# EAGLE design MicroMod-Big Display-Carrier (EAGLE 9.6.2)
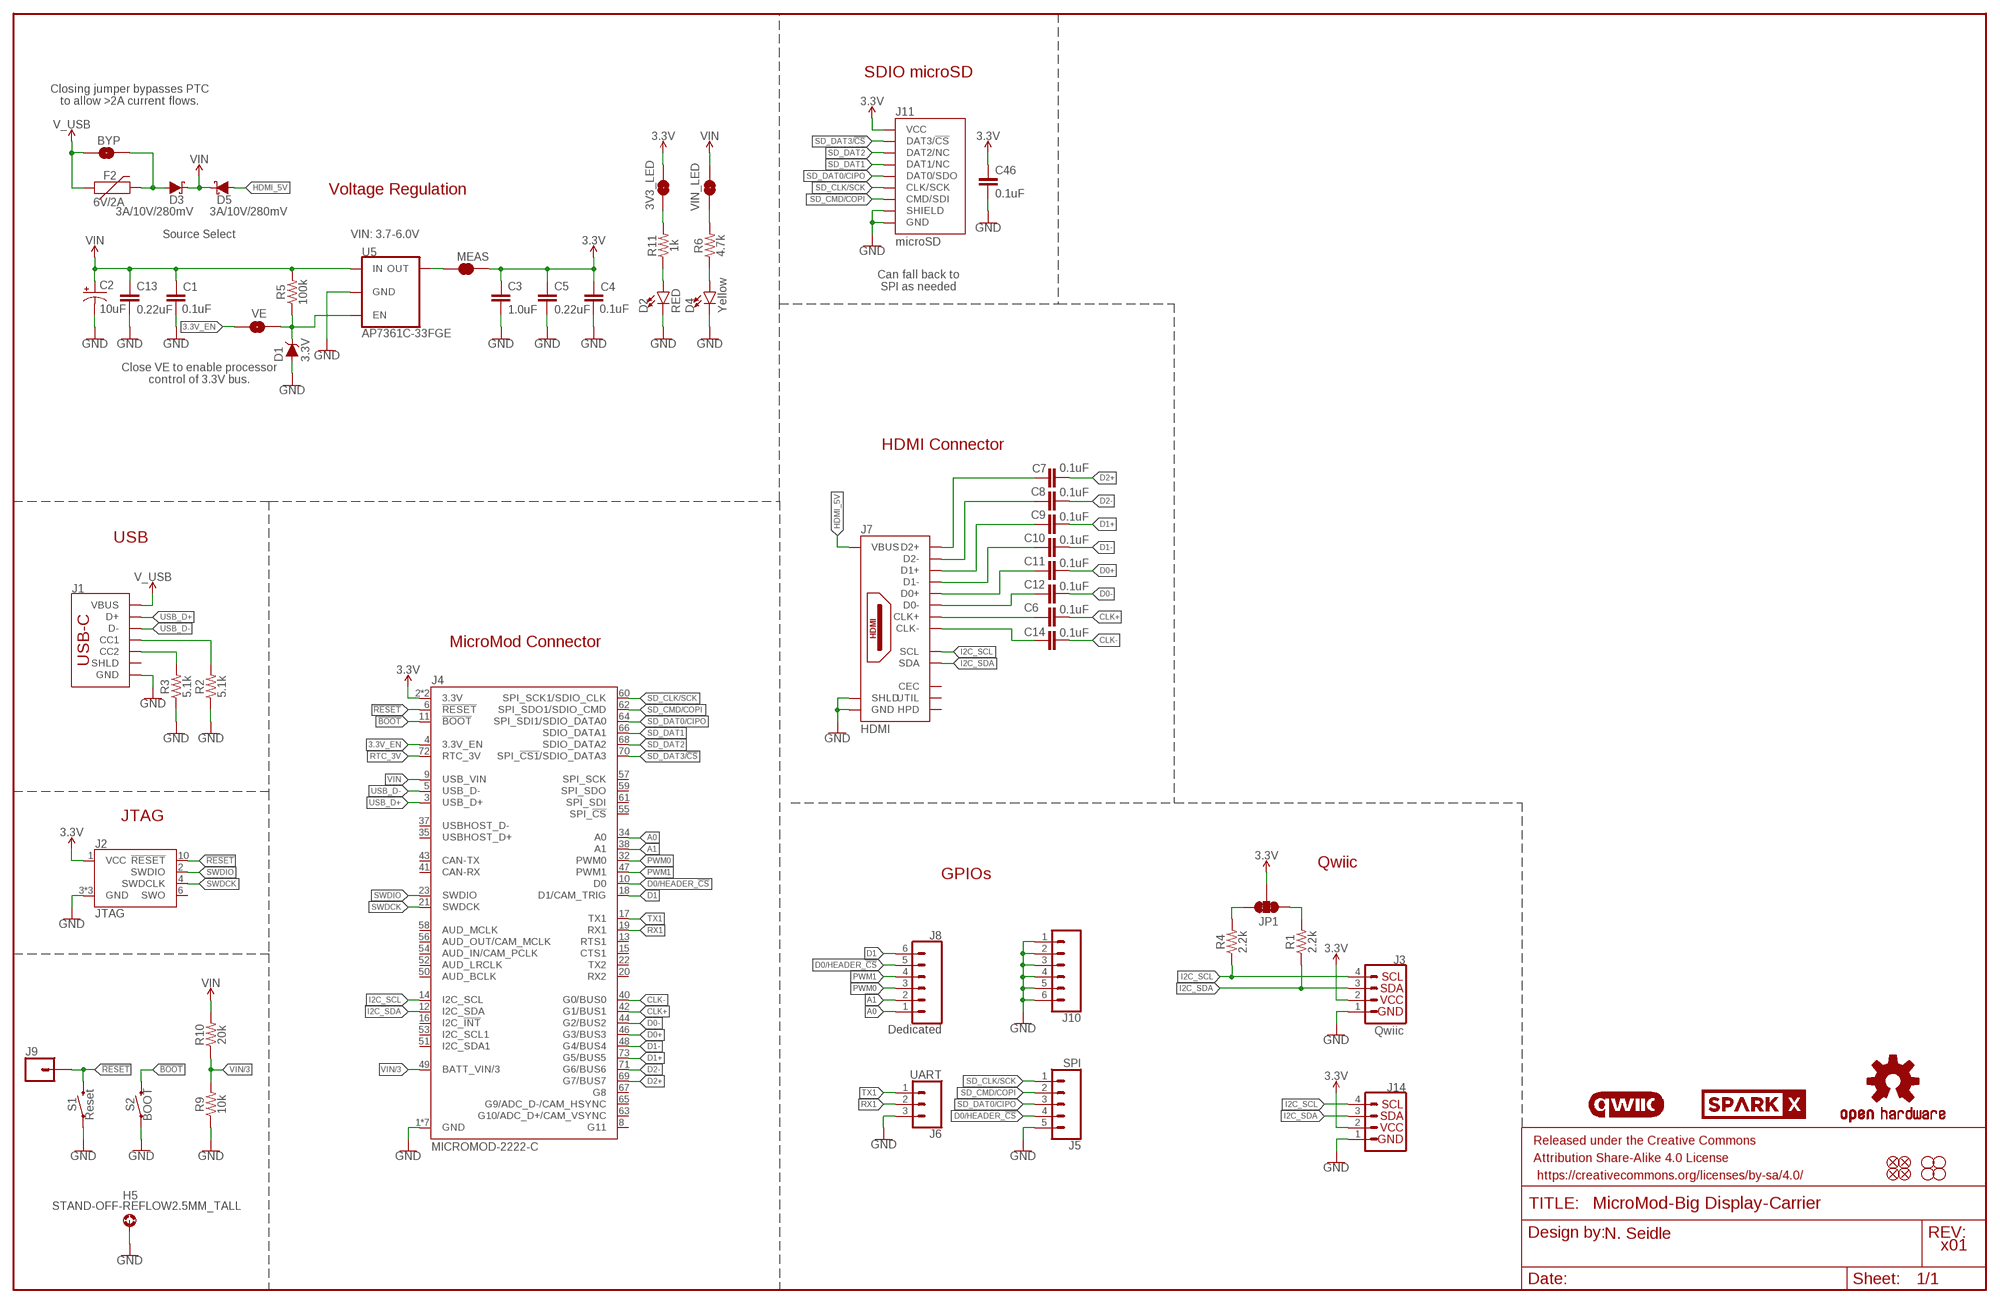
[diagram p0: schematic, sheet 1]

## Parts
3V3_LED  JUMPER-SMT_2_NC_TRACE_SILK  [SMT-JUMPER_2_NC_TRACE_SILK]
BYP  JUMPER-SMT_2_NO_SILK  [SMT-JUMPER_2_NO_SILK]
C1  0.1uF  0.1UF-0603-25V-(+80/-20%)  [0603]
C2  10uF  10UF-POLAR-EIA3216-16V-10%(TANT)  [EIA3216]
C3  1.0uF  1.0UF-0603-16V-10%  [0603]
C4  0.1uF  0.1UF-0603-25V-(+80/-20%)  [0603]
C5  0.22uF  0.22UF-0603-25V-10%  [0603]
C6  0.1uF  0.1UF-0603-25V-5%  [0603]
C7  0.1uF  0.1UF-0603-25V-5%  [0603]
C8  0.1uF  0.1UF-0603-25V-5%  [0603]
C9  0.1uF  0.1UF-0603-25V-5%  [0603]
C10  0.1uF  0.1UF-0603-25V-5%  [0603]
C11  0.1uF  0.1UF-0603-25V-5%  [0603]
C12  0.1uF  0.1UF-0603-25V-5%  [0603]
C13  0.22uF  0.22UF-0603-25V-10%  [0603]
C14  0.1uF  0.1UF-0603-25V-5%  [0603]
C46  0.1uF  0.1UF-0603-25V-(+80/-20%)  [0603]
D1  3.3V  DIODE-ZENER-MM3Z3V3T1G  [SOD-323]
D2  RED  LED-RED0603  [LED-0603]
D3  3A/10V/280mV  DIODE-SCHOTTKY-BAT60A  [SOD-323]
D4  Yellow  LED-YELLOW0603  [LED-0603]
D5  3A/10V/280mV  DIODE-SCHOTTKY-BAT60A  [SOD-323]
F2  6V/2A  PPTC_6V2A  [1210]
FD1  FIDUCIALUFIDUCIAL  [FIDUCIAL-MICRO]
FD2  FIDUCIALUFIDUCIAL  [FIDUCIAL-MICRO]
FD3  FIDUCIALUFIDUCIAL  [FIDUCIAL-MICRO]
FD4  FIDUCIALUFIDUCIAL  [FIDUCIAL-MICRO]
FRAME1  FRAME-LEDGER  [CREATIVE_COMMONS]
H1  STAND-OFF  [STAND-OFF]
H2  STAND-OFF  [STAND-OFF]
H3  STAND-OFF  [STAND-OFF]
H4  STAND-OFF  [STAND-OFF]
H5  STAND-OFF-REFLOW2.5MM_TALL  [STAND-OFF-REFLOW-M2.5]
J1  USB_C_2-LAYER_PADS  [USB-C-16P-2LAYER-PADS]
J2  JTAG  CORTEX_JTAG_DEBUG_MINIMUM_PTH  [2X5-PTH-1.27MM]
J3  Qwiic  QWIIC_CONNECTORJS-1MM  [JST04_1MM_RA]
J4  MICROMOD-2222-C  [M.2-CONNECTOR-E]
J5  SPI  CONN_05NO_SILK  [1X05_NO_SILK]
J6  UART  CONN_031X03_NO_SILK  [1X03_NO_SILK]
J7  HDMI  MOLEX_HDMI_208658-1051  [MOLEX_HDMI_208658-1051]
J8  Dedicated  CONN_06NO_SILK_NO_POP  [1X06_NO_SILK]
J9  CONN_01PTH_NO_SILK_YES_STOP  [1X01_NO_SILK]
J10  CONN_06NO_SILK_NO_POP  [1X06_NO_SILK]
J11  microSD  MICRO-SD-SDIOPUSH-PUSH  [MICRO-SD-SOCKET]
J14  I2C_STANDARD_NO_SILK  [1X04_NO_SILK]
JP1  JUMPER-SMT_3_2-NC_TRACE_SILK  [SMT-JUMPER_3_2-NC_TRACE_SILK]
LOGO2  QWIIC_LOGO_CONNECTOR  [QWIIC_5.5MM]
LOGO3  OSHW-LOGOMINI  [OSHW-LOGO-MINI]
MEAS  JUMPER-COMBO_2_NC_TRACE  [COMBO-JUMPER_2_NC_TRACE]
R1  2.2k  2.2KOHM-0603-1/10W-1%  [0603]
R2  5.1k  5.1KOHM5.1KOHM-0603-1/10W-1%  [0603]
R3  5.1k  5.1KOHM5.1KOHM-0603-1/10W-1%  [0603]
R4  2.2k  2.2KOHM-0603-1/10W-1%  [0603]
R5  100k  100KOHM-0603-1/10W-1%  [0603]
R6  4.7k  4.7KOHM-0603-1/10W-1%  [0603]
R9  10k  10KOHM-0603-1/10W-1%  [0603]
R10  20k  20KOHM-0603-1/10W-1%  [0603]
R11  1k  1KOHM-0603-1/10W-1%  [0603]
S1  Reset  MOMENTARY-SWITCH-SPST-SMD-5.2-TALL-REDUNDANT  [TACTILE_SWITCH_SMD_5.2MM]
S2  BOOT  MOMENTARY-SWITCH-SPST-SMD-5.2-TALL-REDUNDANT  [TACTILE_SWITCH_SMD_5.2MM]
U5  AP7361C-33FGE  AP7361C-33FGEUDFN-8  [UDFN-8]
U$1  SPARKX-LOGO4  [SPARKX-MEDIUM]
VE  JUMPER-SMT_2_NO_SILK  [SMT-JUMPER_2_NO_SILK]
VIN_LED  JUMPER-SMT_2_NC_TRACE_SILK  [SMT-JUMPER_2_NC_TRACE_SILK]

## Nets
3.3V: 3V3_LED.2 C3.1 C4.1 C5.1 C46.1 J2.1(VCC) J3.2 J4.2(3.3V) J4.74(3.3V) J11.VCC J14.2 JP1.2 MEAS.2 MEAS.4
3.3V_EN: J4.4(3.3V_EN) VE.1
!BOOT!: J4.11(!BOOT!) S2.3 S2.4
!RESET!: J2.10(!RESET) J4.6(!RESET!) J9.1 S1.3 S1.4
A0: J4.34(A0) J8.1
A1: J4.38(A1) J8.2
CLK+: C6.1 J4.42(G1/BUS1)
CLK-: C14.1 J4.40(G0/BUS0)
D0+: C11.1 J4.46(G3/BUS3)
D0-: C12.1 J4.44(G2/BUS2)
D0/HEADER_!CS!: J4.10(D0) J5.4 J8.5
D1: J4.18(D1/CAM_TRIG) J8.6
D1+: C9.1 J4.73(G5/BUS5)
D1-: C10.1 J4.48(G4/BUS4)
D2+: C7.1 J4.69(G7/BUS7)
D2-: C8.1 J4.71(G6/BUS6)
GND: C1.2 C2.- C3.2 C4.2 C5.2 C13.2 C46.2 D1.A D2.C D4.C H5.1 J1.GND J1.GND2(GND) J2.3(GND) J2.5(GND) J2.9(GND) J3.1 J4.1(GND) J4.7(GND) J4.33(GND) J4.36(GND) J4.39(GND) J4.45(GND) J4.75(GND) J5.5 J6.3 J7.2(GND) J7.5(GND) J7.8(GND) J7.11(GND) J7.17(GND) J7.MH1(SHLD) J7.MH2(SHLD) J7.MH3(SHLD) J7.MH4(SHLD) J10.1 J10.2 J10.3 J10.4 J10.5 J10.6 J11.CD1(SHIELD) J11.GND J11.GND1(GND) J11.GND3(GND) J14.1 R2.1 R3.1 R9.1 S1.1 S1.2 S2.1 S2.2 U5.4(GND) U5.EP(GND)
HDMI_5V: D5.A J7.18(VBUS)
I2C_SCL: J3.4 J4.14(I2C_SCL) J7.15(SCL) J14.4 R4.1
I2C_SDA: J3.3 J4.12(I2C_SDA) J7.16(SDA) J14.3 R1.1
N$1: R6.2 VIN_LED.1
N$2: JP1.3 R4.2
N$3: JP1.1 R1.2
N$4: C7.2 J7.1(D2+)
N$5: C8.2 J7.3(D2-)
N$6: 3V3_LED.1 R11.2
N$7: D2.A R11.1
N$8: D4.A R6.1
N$9: C9.2 J7.4(D1+)
N$10: J1.A5(CC1) R2.2
N$11: J1.B5(CC2) R3.2
N$12: D1.C R5.1 U5.5(EN) VE.2
N$13: C10.2 J7.6(D1-)
N$14: C11.2 J7.7(D0+)
N$15: C12.2 J7.9(D0-)
N$16: C6.2 J7.10(CLK+)
N$17: C14.2 J7.12(CLK-)
N$18: BYP.2 D3.A F2.2
PWM0: J4.32(PWM0) J8.3
PWM1: J4.47(PWM1) J8.4
RTC_3V: J4.72(RTC_3V)
RX1: J4.19(RX1) J6.2
SD_CLK/SCK: J4.60(SPI_SCK1/SDIO_CLK) J5.1 J11.SCLK(CLK/SCK)
SD_CMD/COPI: J4.62(SPI_SDO1/SDIO_CMD) J5.2 J11.DI/CMD(CMD/SDI)
SD_DAT0/CIPO: J4.64(SPI_SDI1/SDIO_DATA0) J5.3 J11.DO/DAT0(DAT0/SDO)
SD_DAT1: J4.66(SDIO_DATA1) J11.DAT1(DAT1/NC)
SD_DAT2: J4.68(SDIO_DATA2) J11.DAT2(DAT2/NC)
SD_DAT3/!CS!: J4.70(SPI_!CS1!/SDIO_DATA3) J11.CS/DAT3(DAT3/!CS!)
SWDCK: J2.4(SWDCLK) J4.21(SWDCK)
SWDIO: J2.2(SWDIO) J4.23(SWDIO)
TX1: J4.17(TX1) J6.1
USB_D+: J1.A6(D+) J1.B6(D+) J4.3(USB_D+)
USB_D-: J1.A7(D-) J1.B7(D-) J4.5(USB_D-)
V_USB: BYP.1 F2.1 J1.VBUS1(VBUS) J1.VBUS2(VBUS)
VIN: C1.1 C2.+ C13.1 D3.C D5.C J4.9(USB_VIN) R5.2 R10.2 U5.8(IN) VIN_LED.2
VIN/3: J4.49(BATT_VIN/3) R9.2 R10.1
VREG_3.3V: MEAS.1 MEAS.3 U5.1(OUT)
Unconnected: J1.SHLD1(SHLD) J1.SHLD2(SHLD) J1.SHLD3(SHLD) J1.SHLD4(SHLD) J2.6(SWO) J4.8(G11) J4.13(RTS1) J4.15(CTS1) J4.16(I2C_!INT!) J4.20(RX2) J4.22(TX2) J4.35(USBHOST_D+) J4.37(USBHOST_D-) J4.41(CAN-RX) J4.43(CAN-TX) J4.50(AUD_BCLK) J4.51(I2C_SDA1) J4.52(AUD_LRCLK) J4.53(I2C_SCL1) J4.54(AUD_IN/CAM_PCLK) J4.55(SPI_!CS!) J4.56(AUD_OUT/CAM_MCLK) J4.57(SPI_SCK) J4.58(AUD_MCLK) J4.59(SPI_SDO) J4.61(SPI_SDI) J4.63(G10/ADC_D+/CAM_VSYNC) J4.65(G9/ADC_D-/CAM_HSYNC) J4.67(G8) J7.13(CEC) J7.14(UTIL) J7.19(HPD)

## Notes on the sheet
- SDIO microSD
- Closing jumper bypasses PTC
  to allow >2A current flows.
- Voltage Regulation
- Source Select | VIN: 3.7-6.0V
- Can fall back to
  SPI as needed
- Close VE to enable processor
  control of 3.3V bus.
- HDMI Connector
- USB
- MicroMod Connector
- JTAG
- Qwiic
- GPIOs
- N. Seidle
- x01

## Library data of the parts
3V3_LED VIN_LED = SparkFun-Jumpers:JUMPER-SMT_2_NC_TRACE: Normally closed trace jumper This jumper has a trace between two pads so it's normally closed (NC). Use a razor knife to open the connection. For best results follow the IPC guidelines for cutting traces: Cutout at least 0.063 mm (0.005 in). Remove all loose material to clean up the cut area. Seal the cut with an approved epoxy. Reapply solder to reclose the connection.
BYP VE = SparkFun-Jumpers:JUMPER-SMT_2_NO: Normally open jumper This jumper has two pads in close proximity to each other. Apply solder to close the connection. Round pads are easier to solder for beginners, but are a lot larger. SparkFun Product that uses the round pads: SparkFun EL Sequencer
C1 C4 C46 = SparkFun-Capacitors:0.1UF: 0.1µF ceramic capacitors A capacitor is a passive two-terminal electrical component used to store electrical energy temporarily in an electric field.; PROD_ID: CAP-00810
C2 = SparkFun-Capacitors:10UF-POLAR: 10.0µF polarized capacitors A capacitor is a passive two-terminal electrical component used to store electrical energy temporarily in an electric field.; PROD_ID: CAP-00811
C3 = SparkFun-Capacitors:1.0UF: 1µF ceramic capacitors A capacitor is a passive two-terminal electrical component used to store electrical energy temporarily in an electric field.; PROD_ID: CAP-00868
C5 C13 = SparkFun-Capacitors:0.22UF: 0.22µF ceramic capacitors A capacitor is a passive two-terminal electrical component used to store electrical energy temporarily in an electric field.; PROD_ID: CAP-07822
C6-C12 C14 = SparkFun-Capacitors:0.1UF: 0.1µF ceramic capacitors A capacitor is a passive two-terminal electrical component used to store electrical energy temporarily in an electric field.; PROD_ID: CAP-08604
D1 = SparkFun-DiscreteSemi:DIODE-ZENER: Zener Diode A Zener diode allows current to flow from its anode to its cathode like a normal semiconductor diode, but it also permits current to flow in the reverse direction when its "Zener voltage" is reached. - WIkipedia; PROD_ID: DIO-11284
D2 = SparkFun-LED:LED-RED: Red SMD LED Used in manufacturing of most products at SparkFun Packages: 0603 - SMD 0603 package [Product Link] <http://docs.avagotech.com/docs/AV02-0551EN> 0603 SMART - SMD 0603 SMART package ( more efficient and expensive)[Product Link] <http://www.osram-os.com/Graphics/XPic2/00077099_0.pdf> 1206 - SMD1206 package [Product Link] <https://www.sparkfun.com/datasheets/DevTools/LilyPad/Q150OVS4.pdff> SparkFun Products: Pro Mini 328 -5V <https://www.sparkfun.com/products/821> RedBoard <https://www.sparkfun.com/products/12757> IOIO-OTG <https://www.sparkfun.com/products/13613>; PROD_ID: DIO-00819
D3 D5 = SparkFun-DiscreteSemi:DIODE-SCHOTTKY: Schottky diode A Schottky diode is a semiconductor diode which has a low forward voltage drop and a very fast switching action.; PROD_ID: DIO-14072
D4 = SparkFun-LED:LED-YELLOW: Yellow SMD LED Used in manufacturing several products at SparkFun. Packages: 0603 - SMD 0603 package[Product Link] <http://www.kingbrightusa.com/product.asp?catalog_name=LED&product_id=APT1608SYCK> 0603 -SMART - SMART SMD 0603 package (more efficient/more expensive) [Product Link] <http://www.osram-os.com/osram_os/en/products/product-catalog/led-light-emitting-diodes/smartled-0603/ly-l29k/index.jsp> LilyPad - SMD1206 package[Product Datasheet] <https://www.sparkfun.com/datasheets/DevTools/LilyPad/Q150YUS4.pdf> SparkFun Products: Blynk Board <https://www.sparkfun.com/products/13794> IOIO-OTG <https://www.sparkfun.com/products/13613> XBee Explorer Serial <https://www.sparkfun.com/products/13225>; PROD_ID: DIO-09003
F2 = SparkFun-Fuses:PPTC: Resettable Fuse PPTC Resettable Fuse. Really a sort of resistor with a polymeric positive temperature coefficient whose resistance increases dramatically with an increase in temperature. When heated by the power passing through the resistance rises causing the current to be limited, protecting the circuit. This is achieved by the transition of the polymer from a crystalline to an amorphous state where the conductive carbon separates breaking the conductive pathways found in the cool crystalline structure. When a PPTC cools back down it resumes conducting letting the circuit turn back on. SparkFun Products: SparkFun RedBoard - Programmed with Arduino Pro Micro - 5V/16MHz Arduino Pro 328 - 5V/16MHz MP3 Trigger; PROD_ID: RES-14313
FD1-FD4 = SparkFun-Aesthetics:FIDUCIAL: Fiducial Alignment Points Point-of-reference for pick-and-place machines and other optical instruments.
FRAME1 = SparkFun-Aesthetics:FRAME-LEDGER: Schematic Frame - Ledger Standard 11x14 US Ledger frame
H1-H4 = SparkFun-Hardware:STAND-OFF: Stand Off Drill holes for mechanically mounting via screws, standoffs, etc. Note: Use the keepout ring to avoid running the screw head into surrounding components. Variant Overviews STAND-OFF - Mechanical footprint for a #4 phillips button head screw. STAND-OFF-TIGHT - Mechanical footprint for a #4 phillips button head screw, Example SparkFun Products Screw - Phillips Head (1/4", 4-40, 10 pack) (PRT-10453) Screw - Phillips Head (1/2", 4-40, 10 pack) (PRT-10452) Screw - Phillips Head (3/4", 4-40, 10 pack) (PRT-10451) Screw - Phillips Head (1", 4-40, 10 pack) (PRT-10450)
H5 = SparkFun-Hardware:STAND-OFF-REFLOW: Stand Off Reflow Compatible A metal standoff that can be placed and reflowed onto a PCB.; PROD_ID: HW-14899
J1 = SparkFun-Connectors:USB_C: USB Type C 16Pin Connector Super Speed pins not available on the 16-pin purely SMD connector so this part is best for USB 2.0 implementations. D1 and D2 are tied together enabling D+/- no matter which way the cable is plugged into the connector. The two channel configuration pins (CC1/2) are exposed. These are normally connected to ground via 5.1k resistors but can be reconfigured for high current/high power applications. **4-LAYER BOARD WARNING!!** If designing 4-layer board, make sure to select the variant _4-LAYER-ISOLATED. The linked footprint (USB-C-16-4LAYER-ISOLATED) includes some very necessary cutout polygons in the inner layers (2 and 15). This prevents the PTH mounting shield legs on the USB connector from electrically connecting any other polygons on the inner layers (usually VCC and GND).; PROD_ID: CONN-14122
J2 = SparkFun-Connectors:CORTEX_JTAG_DEBUG_MINIMUM: Cortex Debug Connector - 10 pin Supports JTAG debug, Serial Wire debug, and Serial Wire Viewer. PTH and SMD connector options available. General Connector Information <http://infocenter.arm.com/help/topic/com.arm.doc.faqs/attached/13634/cortex_debug_connectors.pdf> Products: PTH Connector <http://www.digikey.com/product-detail/en/cnc-tech/3220-10-0100-00/1175-1627-ND/3883661> -via Digi-Key SparkFun PSoc <https://www.sparkfun.com/products/13229> SparkFun T <https://www.sparkfun.com/products/13810>
J3 = SparkFun-Connectors:QWIIC_CONNECTOR: SparkFun I2C Standard Qwiic Connector An SMD 1mm pitch JST connector makes it easy and quick (get it? Qwiic?) to connect I2C devices to each other. The Qwiic system <http://www.sparkfun.com/qwiic> enables fast and solderless connection between popular platforms and various sensors and actuators. We carry 200mm <https://www.sparkfun.com/products/14204>, 100mm <https://www.sparkfun.com/products/14205>, 50mm <https://www.sparkfun.com/products/14206>, and breadboard friendly <https://www.sparkfun.com/products/14207> Qwiic cables. We also offer 10 pcs strips <https://www.sparkfun.com/products/14323> the SMD connectors.; PROD_ID: CONN-13694; VALUE: QWIIC_RIGHT_ANGLE
J4 = SparkFun-MicroMod:MICROMOD: MicroMod Connector Description: A card edge connector and mating PCB connector to allow various MicroMod Processor Boards to be coupled with various carrier boards of different capabilities. Based on the M.2 standard.; PROD_ID: CONN-14877
J5 = SparkFun-Connectors:CONN_05: Multi connection point. Often used as Generic Header-pin footprint for 0.1 inch spaced/style header connections On any of the 0.1 inch spaced packages, you can populate with these: Break Away Headers - Straight (PRT-00116) Break Away Male Headers - Right Angle (PRT-00553) Female Headers (PRT-00115) Break Away Headers - Machine Pin (PRT-00117) Break Away Female Headers - Swiss Machine Pin (PRT-00743) For SCREWTERMINALS and SPRING TERMINALS visit here: Screw Terimnals on SparkFun.com (5mm/3.5mm/2.54mm spacing) This device is also useful as a general connection point to wire up your design to another part of your project. Our various solder wires solder well into these plated through hole pads. Hook-Up Wire - Assortment (Stranded, 22 AWG) (PRT-11375) Hook-Up Wire - Assortment (Solid Core, 22 AWG) (PRT-11367) View the entire wire category on our website here Special notes: Molex polarized connector foot print use with SKU : PRT-08231 with associated crimp pins and housings. 1MM SMD Version SKU: PRT-10208
J6 = SparkFun-Connectors:CONN_03: Multi connection point. Often used as Generic Header-pin footprint for 0.1 inch spaced/style header connections On any of the 0.1 inch spaced packages, you can populate with these: Break Away Headers - Straight (PRT-00116) Break Away Male Headers - Right Angle (PRT-00553) Female Headers (PRT-00115) Break Away Headers - Machine Pin (PRT-00117) Break Away Female Headers - Swiss Machine Pin (PRT-00743) Stackable Header - 3 Pin (Female, 0.1") (PRT-13875) For SCREWTERMINALS and SPRING TERMINALS visit here: Screw Terimnals on SparkFun.com (5mm/3.5mm/2.54mm spacing) This device is also useful as a general connection point to wire up your design to another part of your project. Our various solder wires solder well into these plated through hole pads. Hook-Up Wire - Assortment (Stranded, 22 AWG) (PRT-11375) Hook-Up Wire - Assortment (Solid Core, 22 AWG) (PRT-11367) View the entire wire category on our website here Special notes: Molex polarized connector foot print use with SKU : PRT-08232 with associated crimp pins and housings.
J7 = New_Parts:MOLEX_HDMI_208658-1051: 1.0 HDMI R/A HEADER ASSY (I/M TYPE) Source: Datasheet
J8 J10 = SparkFun-Connectors:CONN_06: Multi connection point. Often used as Generic Header-pin footprint for 0.1 inch spaced/style header connections On any of the 0.1 inch spaced packages, you can populate with these: Break Away Headers - Straight (PRT-00116) Break Away Male Headers - Right Angle (PRT-00553) Female Headers (PRT-00115) Break Away Headers - Machine Pin (PRT-00117) Break Away Female Headers - Swiss Machine Pin (PRT-00743) Arduino Stackable Header - 6 Pin (PRT-09280) For SCREWTERMINALS and SPRING TERMINALS visit here: Screw Terimnals on SparkFun.com (5mm/3.5mm/2.54mm spacing) This device is also useful as a general connection point to wire up your design to another part of your project. Our various solder wires solder well into these plated through hole pads. Hook-Up Wire - Assortment (Stranded, 22 AWG) (PRT-11375) Hook-Up Wire - Assortment (Solid Core, 22 AWG) (PRT-11367) View the entire wire category on our website here
J9 = SparkFun-Connectors:CONN_01: Single connection point. Often used as Generic Header-pin footprint for 0.1 inch spaced/style header connections On any of the 0.1 inch spaced packages, you can populate with these: Break Away Headers - Straight (PRT-00116) Break Away Male Headers - Right Angle (PRT-00553) Female Headers (PRT-00115) Break Away Headers - Machine Pin (PRT-00117) Break Away Female Headers - Swiss Machine Pin (PRT-00743) This device is also useful as a general connection point to wire up your design to another part of your project. Our various solder wires solder well into these plated through hole pads. Hook-Up Wire - Assortment (Stranded, 22 AWG) (PRT-11375) Hook-Up Wire - Assortment (Solid Core, 22 AWG) (PRT-11367) View the entire wire category on our website here Special notes: SMTSO-256-ET is a "flush mount" nut for a 4-40 screw. We mostly use this on specialty testbeds; it is a nice way to connect hardware to your PCB at an adjustable hieght. Also note, the SNAP packages are for using a snappable style connector. We sell a baggie of snaps and they are also used on two LilyPad designs: Snap Assortment - 30 pack (male and female) (DEV-11347) LilyPad Arduino SimpleSnap (DEV-10941) LilyPad SimpleSnap Protoboard (DEV-10940)
J11 = SparkFun-Connectors:MICRO-SD-SDIO: microSD Socket for Transflash Push-push type µSD socket. tDoc lines correctly indicate media card edge positions when inserting (unlocked, locked, depressed). NOTE: CD1 and CD2 are connected internally, and the default detect state of the socket is detect pin to ground. SparkFun Products: WAV Trigger <https://www.sparkfun.com/products/13660> CAN-Bus Shield <https://www.sparkfun.com/products/13262> SparkFun Level Shifing microSD Breakout <https://www.sparkfun.com/products/13743>; PROD_ID: CONN-07820
J14 = SparkFun-Connectors:I2C_STANDARD: SparkFun I2C Standard Pinout Header SparkFun has standardized on a pinout for all I2C based sensor breakouts. This pinout allows I2C boards to be plugged directly into the headers on Arduino Uno compatible boards, and to be daisy chained easily. Example SparkFun Products: SparkFun Atmospheric Sensor Breakout - BME280 <https://www.sparkfun.com/products/13676> SparkFun Altitude/Pressure Sensor Breakout - MPL3115A2 <https://www.sparkfun.com/products/11084> SparkFun TOF Range Finder Sensor - VL6180 <https://www.sparkfun.com/products/12785>
JP1 = SparkFun-Jumpers:JUMPER-SMT_3_2-NC_TRACE: Normally closed trace jumper (2 of 2 connections) This jumper has a trace between all three pads so they are normally closed (NC). Use a razor knife to open the connection(s). For best results follow the IPC guidelines for cutting traces: Cutout at least 0.063 mm (0.005 in). Remove all loose material to clean up the cut area. Seal the cut with an approved epoxy. Reapply solder to reclose the connection(s).
LOGO2 = SparkFun-Aesthetics:QWIIC_LOGO: Qwiic Logos for placement on schematic and PCB. The 5.5mm silk logo is best for placing next to Qwiic connector.
LOGO3 = SparkFun-Aesthetics:OSHW-LOGO: Open-Source Hardware (OSHW) Logo This logo indicates the piece of hardware it is found on incorporates a OSHW license and/or adheres to the definition of open source hardware found here: http://freedomdefined.org/OSHW
MEAS = SparkFun-Jumpers:JUMPER-COMBO_2_NC_TRACE
R1 R4 = SparkFun-Resistors:2.2KOHM: 2.2kΩ resistor A resistor is a passive two-terminal electrical component that implements electrical resistance as a circuit element. Resistors act to reduce current flow, and, at the same time, act to lower voltage levels within circuits. - Wikipedia; PROD_ID: RES-08272
R2 R3 = SparkFun-Resistors:5.1KOHM; PROD_ID: RES-12083
R5 = SparkFun-Resistors:100KOHM: 100kΩ resistor A resistor is a passive two-terminal electrical component that implements electrical resistance as a circuit element. Resistors act to reduce current flow, and, at the same time, act to lower voltage levels within circuits. - Wikipedia; PROD_ID: RES-07828
R6 = SparkFun-Resistors:4.7KOHM: 4.7kΩ resistor A resistor is a passive two-terminal electrical component that implements electrical resistance as a circuit element. Resistors act to reduce current flow, and, at the same time, act to lower voltage levels within circuits. - Wikipedia; PROD_ID: RES-07857
R9 = SparkFun-Resistors:10KOHM: 10kΩ resistor A resistor is a passive two-terminal electrical component that implements electrical resistance as a circuit element. Resistors act to reduce current flow, and, at the same time, act to lower voltage levels within circuits. - Wikipedia; PROD_ID: RES-00824
R10 = SparkFun-Resistors:20KOHM: 20kΩ resistor A resistor is a passive two-terminal electrical component that implements electrical resistance as a circuit element. Resistors act to reduce current flow, and, at the same time, act to lower voltage levels within circuits. - Wikipedia; PROD_ID: RES-09383
R11 = SparkFun-Resistors:1KOHM: 1kΩ resistor A resistor is a passive two-terminal electrical component that implements electrical resistance as a circuit element. Resistors act to reduce current flow, and, at the same time, act to lower voltage levels within circuits. - Wikipedia; PROD_ID: RES-07856
S1 S2 = SparkFun-Switches:MOMENTARY-SWITCH-SPST: Momentary Switch (Pushbutton) - SPST Normally-open (NO) SPST momentary switches (buttons, pushbuttons). Variants PTH-12MM - 12mm square, through-hole Momentary Pushbutton Switch - 12mm Square (COM-09190) PTH-6.0MM, PTH-6.0MM-KIT - 6.0mm square, through-hole Mini Pushbutton Switch (COM-00097) KIT package intended for soldering kit's - only one side of pads' copper is exposed. PTH-RIGHT-ANGLE-KIT - Right-angle, through-hole Right Angle Tactile Button - Used on SparkFun BigTime Watch Kit SMD-12MM - 12mm square, surface-mount Tactile Button - SMD (12mm) (COM-12993) Used on SparkFun PicoBoard SMD-4.5MM - 4.5mm Square Trackball Switch Used on SparkFun Blackberry Trackballer Breakout SMD-4.6MMX2.8MM - 4.60mm x 2.80mm, surface mount Used on SparkFun SAMD21 Mini Breakout SMD-5.2MM, SMD-5.2-REDUNDANT - 5.2mm square, surface-mount Mini Pushbutton Switch - SMD (COM-08720) Used on Arduino Pro Mini REDUNDANT package connects both switch circuits together SMD-6.0X3.5MM - 6.0 x 3.5mm, surface mount Momentary Reset Switch SMD (COM-08229) SMD-6.2MM-TALL - 6.2mm square, surface mount Tactile Button - SMD (6mm) Used on SparkFun Digital Sandbox SMD-RIGHT-ANGLE - Right-angle, surface mount Used on SparkFun Block for Intel® Edison - Arduino; PROD_ID: SWCH-14139
U5 = SparkFun-IC-Power:AP7361C-33FGE: AP7361C 3.3V LDO Regulator; PROD_ID: VREG-14094
U$1 = SparkX:SPARKX-LOGO

## Net classes
0 default: width 0 mm, drill 0 mm
1 power: width 0.762 mm

## Board
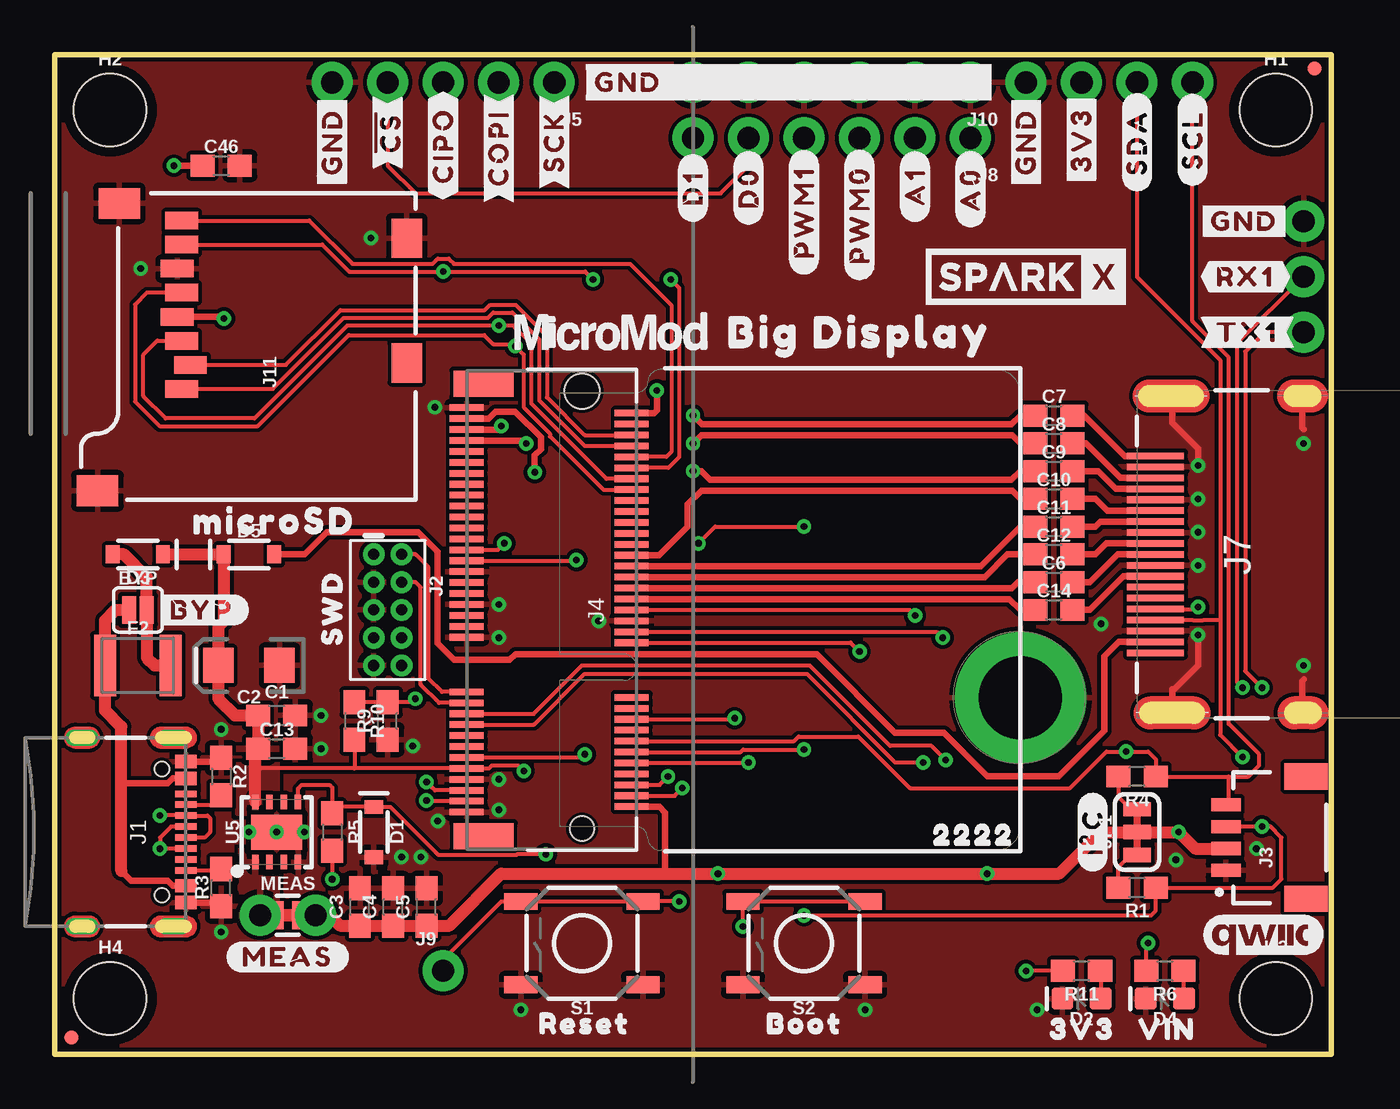
[diagram p1: board, top side]
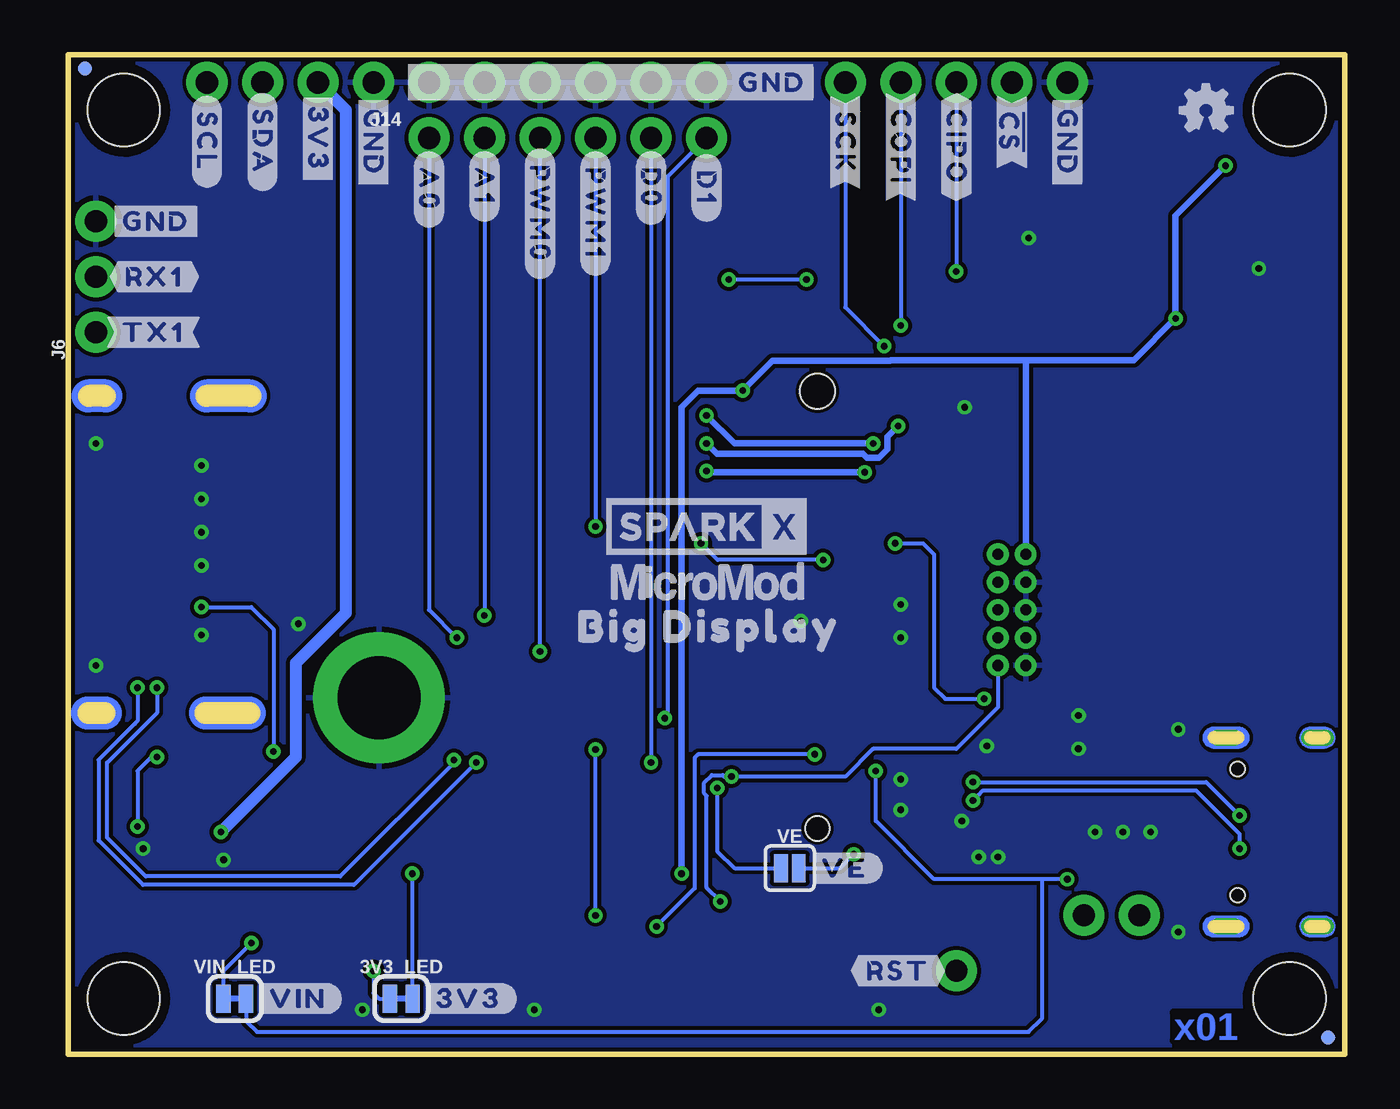
[diagram p2: board, bottom side, seen from below]

Size 58.42 x 45.72 mm. Coordinates in mm from the lower left corner, seen from the top.
Outline: 0,0 0,45.72 58.42,45.72 58.42,0 0,0
Copper layers (1*16): Top 0.035mm / dielectric 1.5mm / Bottom 0.035mm
Design rules "SparkFun-2-layer-TIGHT *": minimum track width 7mil, minimum drill 12mil, track to track 7mil, track to pad 7mil, pad to pad 7mil, via to via 7mil, smd to smd 7mil, copper to edge 7mil, drill to drill 7mil, minimum pad ring 7mil, minimum via ring 7mil, stop-mask expansion 4mil, vias tented up to drill 25mil, thermal gap 10mil

### Footprints (pad centres in the part's own frame; a part is rotated, then mirrored left to right if it is on the bottom)
SMT-JUMPER_2_NC_TRACE_SILK = smd 0.66 x 1.27: 1 -0.521,0; 2 0.521,0
SMT-JUMPER_2_NO_SILK = smd 0.635 x 1.27: 1 -0.406,0; 2 0.406,0
0603 = smd 1.1 x 1: 1 -0.85,0; 2 0.85,0
EIA3216 = smd 1.4 x 1.6: + 1.4,0; - -1.4,0
SOD-323 = smd 0.63 x 0.83: A 1.15,0; C -1.15,0
LED-0603 = smd 1 x 1: A -0.877,0; C 0.877,0
1210 = smd 1 x 2.8: 1 -1.5,0; 2 1.5,0
FIDUCIAL-MICRO = smd 0.635 x 0.635: 1 0,0
STAND-OFF = hole 3.302: 0,0
STAND-OFF-REFLOW-M2.5 = drill 3.8 pad 6: 1 0,0
USB-C-16P-2LAYER-PADS = smd 0.3 x 1: A5 -1.25,-0.34; A6 -0.25,-0.34; A7 0.25,-0.34; A8 1.25,-0.34; B5 1.75,-0.34; B6 0.75,-0.34; B7 -0.75,-0.34; B8 -1.75,-0.34 | smd 0.6 x 1: GND -3.225,-0.34; GND2 3.225,-0.34; VBUS1 -2.45,-0.34; VBUS2 2.45,-0.34 | drill 0.4 pad 0.6 long: SHLD1 -4.318,-0.915; SHLD2 4.318,-0.915; SHLD3 -4.318,-5.095; SHLD4 4.318,-5.095 | hole 0.65: -2.89,-1.445; 2.89,-1.445
2X5-PTH-1.27MM = drill 0.508 pad 1: 1 -2.54,-0.635; 2 -2.54,0.635; 3 -1.27,-0.635; 4 -1.27,0.635; 5 0,-0.635; 6 0,0.635; 7 1.27,-0.635; 8 1.27,0.635; 9 2.54,-0.635; 10 2.54,0.635
JST04_1MM_RA = smd 0.6 x 1.35: 1 -1.5,0; 2 -0.5,0; 3 0.5,0; 4 1.5,0 | smd 1.2 x 2: NC1 2.8,-3.675; NC2 -2.8,-3.675
M.2-CONNECTOR-E = smd 0.3 x 1.55: 1 9.25,-5.275; 2 9,2.275; 3 8.75,-5.275; 4 8.5,2.275; 5 8.25,-5.275; 6 8,2.275; 7 7.75,-5.275; 8 7.5,2.275; 9 7.25,-5.275; 10 7,2.275; 11 6.75,-5.275; 12 6.5,2.275; 13 6.25,-5.275; 14 6,2.275; 15 5.75,-5.275; 16 5.5,2.275; 17 5.25,-5.275; 18 5,2.275; 19 4.75,-5.275; 20 4.5,2.275; 21 4.25,-5.275; 22 4,2.275; 23 3.75,-5.275; 32 1.5,2.275; 33 1.25,-5.275; 34 1,2.275; 35 0.75,-5.275; 36 0.5,2.275; 37 0.25,-5.275; 38 0,2.275; 39 -0.25,-5.275; 40 -0.5,2.275; 41 -0.75,-5.275; 42 -1,2.275; 43 -1.25,-5.275; 44 -1.5,2.275; 45 -1.75,-5.275; 46 -2,2.275; 47 -2.25,-5.275; 48 -2.5,2.275; 49 -2.75,-5.275; 50 -3,2.275; 51 -3.25,-5.275; 52 -3.5,2.275; 53 -3.75,-5.275; 54 -4,2.275; 55 -4.25,-5.275; 56 -4.5,2.275; 57 -4.75,-5.275; 58 -5,2.275; 59 -5.25,-5.275; 60 -5.5,2.275; 61 -5.75,-5.275; 62 -6,2.275; 63 -6.25,-5.275; 64 -6.5,2.275; 65 -6.75,-5.275; 66 -7,2.275; 67 -7.25,-5.275; 68 -7.5,2.275; 69 -7.75,-5.275; 70 -8,2.275; 71 -8.25,-5.275; 72 -8.5,2.275; 73 -8.75,-5.275; 74 -9,2.275; 75 -9.25,-5.275 | smd 1.2 x 2.75: A1 10.35,-4.5; A2 -10.35,-4.5 | hole 1.1: 10,0 | hole 1.6: -10,0
1X05_NO_SILK = drill 1.016 pad 1.88: 1 0,0; 2 2.54,0; 3 5.08,0; 4 7.62,0; 5 10.16,0
1X03_NO_SILK = drill 1.016 pad 1.88: 1 0,0; 2 2.54,0; 3 5.08,0
MOLEX_HDMI_208658-1051 = smd 0.3 x 2.6: 1 4.5,4.235; 2 4,4.235; 3 3.5,4.235; 4 3,4.235; 5 2.5,4.235; 6 2,4.235; 7 1.5,4.235; 8 1,4.235; 9 0.5,4.235; 10 0,4.235; 11 -0.5,4.235; 12 -1,4.235; 13 -1.5,4.235; 14 -2,4.235; 15 -2.5,4.235; 16 -3,4.235; 17 -3.5,4.235; 18 -4,4.235; 19 -4.5,4.235 | drill 0.4 long: MH1 -7.25,3.475; MH2 7.25,3.475; MH3 -7.25,-2.485; MH4 7.25,-2.485
1X06_NO_SILK = drill 1.016 pad 1.88: 1 0,0; 2 2.54,0; 3 5.08,0; 4 7.62,0; 5 10.16,0; 6 12.7,0
1X01_NO_SILK = drill 1.016 pad 1.88: 1 0,0
MICRO-SD-SOCKET = smd 1.8 x 1.4: CD1 -2.05,0.4; CD2 -7.75,0.4 | smd 0.8 x 1.5: CS/DAT3 -7.84,10.3; DAT1 -1.24,10.7; DAT2 -8.94,10.7; DI/CMD -6.74,10.7; DO/DAT0 -2.34,10.7; GND -3.44,10.9; SCLK -4.54,10.7; VCC -5.64,10.9 | smd 1.4 x 1.9: GND1 -13.6,14.55; GND3 -0.45,13.55
1X04_NO_SILK = drill 1.016 pad 1.88: 1 0,0; 2 2.54,0; 3 5.08,0; 4 7.62,0
SMT-JUMPER_3_2-NC_TRACE_SILK = smd 0.66 x 1.27: 1 -1.041,0; 2 0,0; 3 1.041,0
COMBO-JUMPER_2_NC_TRACE = smd 0.635 x 1.27: 1 -0.508,0; 2 0.508,0 | drill 1.016 pad 1.88: 3 -1.27,0; 4 1.27,0
TACTILE_SWITCH_SMD_5.2MM = smd 1.524 x 0.762: 1 -2.794,1.905; 2 2.794,1.905; 3 -2.794,-1.905; 4 2.794,-1.905
UDFN-8 = smd 0.3 x 0.65: 1 -0.975,-1.375; 2 -0.325,-1.375; 3 0.325,-1.375; 4 0.975,-1.375; 5 0.975,1.375; 6 0.325,1.375; 7 -0.325,1.375; 8 -0.975,1.375 | smd 2.35 x 1.6: EP 0,0

### Placement (x,y rotation side)
3V3_LED  43.18,2.54 0 bottom
BYP  3.81,20.32 0 top
C1  10.16,15.49 0 top
C2  8.89,17.78 180 top
C3  13.97,6.73 90 top
C4  15.49,6.73 90 top
C5  17.02,6.73 90 top
C6  45.72,21.59 0 top
C7  45.72,29.21 0 top
C8  45.72,27.94 0 top
C9  45.72,26.67 0 top
C10  45.72,25.4 0 top
C11  45.72,24.13 0 top
C12  45.72,22.86 0 top
C13  10.16,13.97 0 top
C14  45.72,20.32 0 top
C46  7.62,40.64 0 top
D1  14.61,10.16 270 top
D2  46.99,2.54 180 top
D3  3.81,22.86 180 top
D4  50.8,2.54 180 top
D5  8.89,22.86 0 top
F2  3.81,17.78 0 top
FD1  0.76,0.76 0 top
FD2  57.66,45.09 0 top
FD3  0.76,0.76 0 bottom
FD4  57.66,45.09 0 bottom
FRAME1  1.27,-10.16 0 top  (outside the outline)
H1  55.88,43.18 0 top
H2  2.54,43.18 0 top
H3  55.88,2.54 0 top
H4  2.54,2.54 0 top
H5  44.2,16.3 0 top
J1  6.35,10.16 270 top
J2  15.24,20.32 270 top
J3  53.59,9.91 90 top
J4  24.13,20.32 270 top
J5  22.86,44.45 180 top
J6  57.15,33.02 90 bottom
J7  54.61,22.86 90 top
J8  41.91,41.91 180 top
J9  17.78,3.81 0 top
J10  41.91,44.45 180 top
J11  16.51,39.37 90 top
J14  44.45,44.45 180 bottom
JP1  49.53,10.16 90 top
LOGO2  55.31,5.46 0 top
LOGO3  6.35,43.18 0 bottom
MEAS  10.67,6.35 0 top
R1  49.53,7.62 180 top
R2  7.62,12.7 270 top
R3  7.62,7.62 90 top
R4  49.53,12.7 180 top
R5  12.7,10.16 270 top
R6  50.8,3.81 180 top
R9  15.24,15.24 90 top
R10  13.72,15.24 270 top
R11  46.99,3.81 180 top
S1  24.13,5.08 180 top
S2  34.29,5.08 180 top
U5  10.16,10.16 0 top
U$1  44.45,35.56 0 top
U$2  [MICROSD0]  10.03,24.38 0 top
U$3  [BIG_DISPLAY0]  36.83,33.02 0 top
U$4  [#3V3#0]  42.29,2.54 0 bottom
U$5  [BIG_DISPLAY0]  29.08,19.56 0 bottom
U$6  [#A0#5]  41.91,37.85 90 top
U$7  [#A0#5]  41.91,41.27 270 bottom
U$8  [#A1#4]  39.37,38.1 90 top
U$9  [#A1#4]  39.37,41.27 270 bottom
U$10  [#D0#1]  31.75,41.27 270 bottom
U$11  [#GND#0]  24,44.45 0 top
U$12  [#GND#0]  28.45,44.45 0 bottom
U$13  [#3V3#1]  46.99,39.62 90 top
U$14  [#3V3#1]  46.99,44.07 270 bottom
U$15  [#GND#0]  44.45,39.5 90 top
U$16  [#GND#0]  44.45,43.94 270 bottom
U$17  [#RST#1]  22.61,3.81 0 bottom
U$18  [#VE#0]  24.64,8.51 0 bottom
U$19  [#MEAS#2]  7.87,4.45 0 top
U$20  [#VIN#1]  49.91,2.54 0 bottom
U$21  [SWD0]  12.7,18.03 90 top
U$22  SPARKX-LOGO4  [SPARKX-MEDIUM]  29.21,24.13 0 bottom
U$23  [#I�C#0]  47.5,8.38 90 top
U$24  [MICROMOD_LOGO_.35]  25.4,33.02 0 top
U$25  [#D0#1]  31.75,37.97 90 top
U$29  [#D1#0]  29.21,38.1 90 top
U$31  [#D1#0]  29.21,41.15 270 bottom
U$32  [#PWM0#3]  36.83,35.43 90 top
U$33  [#BYP#1]  4.57,20.32 0 top
U$34  [MICROMOD_LOGO_.35]  29.21,21.59 0 bottom
U$35  [##CS##3]  15.24,40.51 90 top
U$36  [3V37]  44.83,1.14 0 top
U$38  [22223]  39.5,10.03 0 top
U$40  [BOOT5]  31.88,1.4 0 top
U$41  [#PWM0#3]  36.83,41.4 270 bottom
U$42  [#PWM1#2]  34.29,35.69 90 top
U$43  [#SCL#3]  52.07,39.75 90 top
U$44  [#SCL#3]  52.07,43.81 270 bottom
U$45  [RESET6]  21.46,1.4 0 top
U$46  [VIN8]  48.9,1.14 0 top
U$49  [#PWM1#2]  34.29,41.27 270 bottom
U$50  [#SDA#2]  49.53,39.5 90 top
U$51  [#SDA#2]  49.53,43.94 270 bottom
U$68  [##CS##3]  15.24,43.81 270 bottom
U$69  [#CIPO#2]  17.78,43.94 270 bottom
U$70  [#CIPO#2]  17.78,39.12 90 top
U$71  [#COPI#1]  20.32,38.99 90 top
U$72  [#COPI#1]  20.32,43.94 270 bottom
U$73  [#GND#4]  12.7,39.5 90 top
U$74  [#GND#4]  12.7,43.94 270 bottom
U$75  [#RX1#6]  52.45,35.56 0 top
U$76  [#RX1#6]  56.52,35.56 0 bottom
U$77  [#SCK#0]  22.86,39.62 90 top
U$78  [#SCK#0]  22.86,43.81 270 bottom
U$79  [#TX1#5]  52.45,33.02 0 top
U$80  [#TX1#5]  56.64,33.02 0 bottom
U$81  [#GND#4]  52.2,38.1 0 top
U$82  [#GND#4]  56.64,38.1 0 bottom
VE  25.4,8.51 0 bottom
VIN_LED  50.8,2.54 0 bottom

### Tracks (layer width: path | path; a pad name or v marks a point on that pad's centre or on a via)
3.3V  (via drill 0.3)
  Top 0.178: MEAS.2 MEAS.4
  Top 0.305: J4.2 27.67,11.32 27.94,11.05 27.94,8.26 | J4.74 27.42,29.32 27.56,29.46 v27.56,30.35 | J11.VCC 7.67,33.73 v7.75,33.66 | C46.1 v5.46,40.64
  Top 0.559: MEAS.4 12.57,6.35 13.04,5.88 C3.1 C4.1 C5.1 18.06,5.88 20.43,8.26 27.94,8.26 v30.35,8.26 v42.67,8.26 45.97,8.26 47.88,10.16 JP1.2 v51.44,10.16 52.2,9.4 53.59,9.4 J3.2
  Bottom 0.178: 3V3_LED.2 42.66,8.24 v42.67,8.26
  Bottom 0.305: v30.35,8.26 30.35,29.59 29.59,30.35 v27.56,30.35 26.19,31.73 20.81,31.73 20.78,31.75 14.61,31.75 | 14.61,31.75 9.65,31.75 v7.75,33.66 7.75,38.35 v5.46,40.64 | J2.1 14.61,31.75
  Bottom 0.559: v51.44,10.16 48.01,13.59 48.01,17.89 45.72,20.18 45.72,43.18 J14.2
3.3V_EN  (via drill 0.3)
  Top 0.178: J4.4 28.37,11.82 v28.72,12.17
  Bottom 0.178: v28.72,12.17 28.72,9.29 27.94,8.51 VE.1
!BOOT!  (via drill 0.3)
  Top 0.178: J4.11 24.11,13.57 v24.26,13.72 | v31.5,5.84 S2.4 S2.3
  Bottom 0.178: v24.26,13.72 29.59,13.72 29.76,13.55 29.76,7.58 v31.5,5.84
!RESET!  (via drill 0.3)
  Top 0.178: J4.6 27.69,12.32 v28.07,12.7 | v28.57,6.99 S1.3 S1.4 20.45,6.99 17.78,4.32 J9.1
  Bottom 0.178: v28.57,6.99 29.21,7.62 29.21,11.81 29.32,11.92 29.32,12.42 28.97,12.77 28.48,12.77 28.41,12.7 v28.07,12.7 22.86,12.7 21.59,13.97 17.78,13.97 15.88,15.88 J2.10
A0  (via drill 0.3)
  Top 0.178: J4.34 40.37,19.32 v40.64,19.05
  Bottom 0.178: J8.1 41.91,20.32 v40.64,19.05
A1  (via drill 0.3)
  Top 0.178: J4.38 39.12,20.32 v39.37,20.07
  Bottom 0.178: J8.2 v39.37,20.07
CLK+
  Top 0.305: J4.42 43.8,21.32 44.07,21.59 C6.1
CLK-
  Top 0.305: J4.40 43.7,20.82 44.2,20.32 C14.1
D0+
  Top 0.305: J4.46 42.39,22.32 44.2,24.13 C11.1
D0-
  Top 0.305: J4.44 42.57,21.82 43.61,22.86 C12.1
D0/HEADER_!CS!  (via drill 0.3)
  Top 0.178: J4.10 31.73,13.32 v31.75,13.34 | J5.4 15.24,40.64 16.51,39.37 30.48,39.37 31.75,40.64 J8.5
  Bottom 0.178: J8.5 v31.75,13.34
D1  (via drill 0.3)
  Top 0.178: J4.18 31.07,15.32 v31.11,15.37
  Bottom 0.178: J8.6 30.99,40.13 30.99,15.49 v31.11,15.37
D1+  (via drill 0.3)
  Top 0.305: J4.73 19.85,29.07 20.17,29.39 21.07,29.39 22.25,28.21 22.25,27.67 21.97,27.39 v21.97,26.62 | v29.21,26.67 29.59,26.67 30,26.26 43.79,26.26 44.2,26.67 C9.1
  Bottom 0.305: v21.97,26.62 29.16,26.62 v29.21,26.67
D1-
  Top 0.305: C10.1 44.2,25.4 43.81,25.78 29.59,25.78 28.96,25.15 28.96,24.13 27.65,22.82 J4.48
D2+  (via drill 0.3)
  Top 0.305: J4.69 21.46,28.07 v21.59,27.94 | v29.21,29.21 29.62,28.8 43.79,28.8 44.2,29.21 C7.1
  Bottom 0.305: v21.59,27.94 27.94,27.94 v29.21,29.21
D2-  (via drill 0.3)
  Top 0.305: J4.71 20.29,28.57 v20.45,28.73 | v29.21,27.94 29.59,28.32 43.81,28.32 44.2,27.94 C8.1
  Bottom 0.305: v20.45,28.73 20.93,28.25 20.93,27.67 21.32,27.28 21.86,27.28 22.04,27.46 28.73,27.46 v29.21,27.94
GND  (via drill 0.3)
  Top 0.305: J7.MH3 57.09,17.09 57.15,17.14 | v52.32,19.18 52.32,17.78 51.23,16.69 | 51.23,16.69 51.13,16.69 | J7.MH1 51.13,16.59 51.23,16.69 | J7.MH2 51.13,28.88 52.32,27.69 v52.32,26.92 | J7.MH4 57.09,28.63 57.15,28.57 | J1.GND 7.46,13.38 R2.1 | J1.GND2 7.46,6.93 R3.1
  other vias: 12.19,15.49 12.19,13.97 10.16,10.16 11.43,10.16 8.89,10.16 7.62,14.86 7.62,5.59 15.88,9.02 16.76,9.02 20.32,12.57 20.32,11.18 17.53,10.67 20.32,20.57 20.32,19.05 24.89,19.81 17.4,29.59 3.94,35.94 14.48,37.34 52.32,25.4 52.32,23.88 52.32,22.35 51.31,8.89 54.99,9.4 44.96,2.03 37.08,2.03 21.34,2.03 57.15,27.94 57.15,17.78 47.88,19.68 16.38,14.1
  pour Bottom (isolate 0.178): 0,45.72 58.42,45.72 58.42,0 0,0
  pour Top (isolate 0.178, rank 3): 0,45.72 58.42,45.72 58.42,0 0,0
HDMI_5V
  Top 0.305: J7.18 48.7,18.86 48.04,18.19 48.04,14.79 45.96,12.72 42.69,12.72 40.7,14.71 38.46,14.71 34.88,18.29 21.08,18.29 20.83,18.03 18.29,18.03 17.53,18.8 17.53,22.99 16.64,23.88 12.45,23.88 11.43,22.86 D5.A
I2C_SCL  (via drill 0.3)
  Top 0.178: J14.4 52.07,33.53 53.72,31.88 53.72,15.11 55.12,13.72 55.12,13.21 54.61,12.7 53.72,12.7 | J3.4 53.72,11.53 53.72,12.7 | 53.72,12.7 R4.1 50.38,13.5 50.04,13.84 v49.02,13.84 48.13,13.84 46.46,12.17 39.14,12.17 36.78,14.53 34.04,14.53 33.83,14.32 J4.14 | J7.15 52.24,20.36 v52.32,20.45
  Bottom 0.178: v52.32,20.45 50.04,20.45 49.02,19.43 v49.02,13.84
I2C_SDA  (via drill 0.3)
  Top 0.178: J14.3 49.53,35.56 53.34,31.75 53.34,19.81 | v54.36,13.59 53.34,14.61 53.34,19.81 | J3.3 v55.24,10.41 55.63,10.41 56.13,9.91 56.13,8 55.75,7.62 R1.1 50.38,6.57 50.15,6.34 34.3,6.34 v34.29,6.35 | 53.34,19.81 53.29,19.86 52.58,19.86 52.57,19.85 52.08,19.85 52.07,19.86 J7.16 | J4.12 31.39,13.82 31.5,13.93 v34.29,13.93
  Bottom 0.178: v54.36,13.59 54.61,13.59 55.24,12.95 v55.24,10.41 | v34.29,6.35 v34.29,13.93
N$1  (via drill 0.3)
  Top 0.178: R6.2 49.95,4.99 v50.04,5.08
  Bottom 0.178: v50.04,5.08 51.32,3.8 VIN_LED.1
N$2
  Top 0.178: R4.2 48.68,11.77 49.25,11.2 JP1.3
N$3
  Top 0.178: R1.2 48.68,8.55 49.25,9.12 JP1.1
N$4
  Top 0.305: J7.1 48.97,27.36 47.12,29.21 C7.2
N$5
  Top 0.305: J7.3 48.78,26.36 47.2,27.94 C8.2
N$6  (via drill 0.3)
  Top 0.178: R11.2 v44.45,3.81
  Bottom 0.178: v44.45,3.81 44.45,2.79 44.2,2.54 3V3_LED.1
N$7
  Top 0.178: R11.1 47.87,3.78 D2.A
N$8
  Top 0.178: R6.1 51.65,2.57 D4.A
N$9
  Top 0.305: J7.4 48.56,25.86 47.75,26.67 C9.2
N$10
  Top 0.178: J1.A5 7.18,11.41 R2.2
N$11
  Top 0.178: J1.B5 7.56,8.41 R3.2
N$12  (via drill 0.3)
  Top 0.178: U5.5 11.13,12.15 11.3,12.32 12.57,12.32 12.7,12.19 R5.1 13,11.31 D1.C 15.37,11.3 17.57,9.1 21.11,9.1 21.16,9.14 v22.48,9.14
  Bottom 0.178: VE.2 23.11,8.51 v22.48,9.14
N$13
  Top 0.305: J7.6 48.16,24.86 47.62,25.4 C10.2
N$14
  Top 0.305: J7.7 47.85,24.36 47.62,24.13 C11.2
N$15
  Top 0.305: J7.9 48.12,23.36 47.62,22.86 C12.2
N$16
  Top 0.305: J7.10 48.64,22.86 47.37,21.59 C6.2
N$17
  Top 0.305: J7.12 48.91,21.86 47.37,20.32 C14.2
N$18
  Top 0.559: D3.A 3.17,22.86 4.22,21.82 BYP.2 4.22,18.14 4.57,17.78 F2.2
PWM0  (via drill 0.3)
  Top 0.178: J4.32 36.42,18.82 v36.83,18.41
  Bottom 0.178: J8.3 36.83,19.18 36.83,19.05 v36.83,18.41
PWM1  (via drill 0.3)
  Top 0.178: J4.47 23.84,22.57 v23.88,22.61 | v29.46,23.37 30.23,24.13 v34.29,24.13
  Bottom 0.178: J8.4 v34.29,24.13 | v23.88,22.61 28.7,22.61 v29.46,23.37
RX1  (via drill 0.3)
  Top 0.178: J4.19 21.92,15.57 24.13,17.78 34.54,17.78 38.23,14.1 40.13,14.1 v40.77,13.46 | J6.2 54.1,32.51 54.1,17.02 v54.36,16.76
  Bottom 0.178: v40.77,13.46 40.77,13.34 45.97,8.13 54.86,8.13 56.64,9.91 56.64,13.33 54.61,15.36 54.36,15.62 v54.36,16.76
SD_CLK/SCK  (via drill 0.3)
  Top 0.178: J11.SCLK 4.22,34.83 3.68,34.29 3.68,29.84 4.8,28.73 9.29,28.73 13.46,32.89 19.65,32.89 20.07,32.47 20.99,32.47 v21.08,32.38 21.46,32 21.46,29.59 22.67,28.39 22.67,28.26 25.11,25.82 J4.60
  Bottom 0.178: J5.1 22.86,34.16 v21.08,32.38
SD_CMD/COPI  (via drill 0.3)
  Top 0.178: J4.62 25.25,26.32 23.27,28.3 23.27,28.31 21.82,29.75 21.82,32.49 20.99,33.33 v20.32,33.33 13.39,33.33 9.14,29.08 5.08,29.08 4.06,30.1 4.06,32 4.7,32.64 J11.DI/CMD
  Bottom 0.178: J5.2 v20.32,33.33
SD_DAT0/CIPO  (via drill 0.3)
  Top 0.178: J11.DO/DAT0 12.25,37.03 13.48,35.8 v17.78,35.8 24.27,35.8 v24.64,35.43 | v28.19,35.43 28.57,35.05 28.57,27.3 28.09,26.82 J4.64
  Bottom 0.178: v24.64,35.43 v28.19,35.43 | J5.3 v17.78,35.8
SD_DAT1
  Top 0.178: J11.DAT1 11.65,38.13 13.63,36.15 17.29,36.15 17.53,36.4 18.03,36.4 18.27,36.15 26.33,36.15 28.22,34.27 28.22,27.55 27.99,27.32 J4.66
SD_DAT2
  Top 0.178: J11.DAT2 9.98,30.43 13.23,33.68 19.83,33.68 20.07,33.92 20.95,33.92 22.17,32.7 22.17,29.9 23.62,28.45 24.25,27.82 J4.68
SD_DAT3/!CS!
  Top 0.178: J11.CS/DAT3 10.57,31.53 13.08,34.04 19.68,34.04 19.93,34.28 21.09,34.28 22.53,32.84 22.53,30.05 24.26,28.32 J4.70
SWDCK
  Top 0.178: J4.21 17.59,16.07 16.75,16.9 16.75,21.35 16.51,21.59 J2.4
SWDIO
  Top 0.178: J4.23 17.72,16.57 17.11,17.18 17.11,22.26 16.51,22.86 J2.2
TX1  (via drill 0.3)
  Top 0.178: J4.17 21.93,15.07 24.26,17.4 34.42,17.4 38.48,13.34 v39.75,13.34 | J6.1 55.37,33.02 54.48,32.13 54.48,17.53 v55.24,16.76
  Bottom 0.178: v39.75,13.34 45.34,7.75 54.99,7.75 57.02,9.78 57.02,13.46 55.37,15.11 55.24,15.24 v55.24,16.76
USB_D+  (via drill 0.3)
  Top 0.178: J4.3 17.06,11.57 v17.02,11.61 | J1.B6 v4.84,9.41 v4.83,9.4 4.83,9.91 5.33,10.41 J1.A6
  Bottom 0.178: v17.02,11.61 16.78,11.85 16.77,11.85 16.55,12.06 6.81,12.06 4.83,10.08 v4.83,9.4
USB_D-  (via drill 0.3)
  Top 0.178: v4.83,10.92 6,10.92 J1.B7 7,10.91 7.11,10.79 7.11,10.16 6.86,9.91 J1.A7 | J4.5 17.4,12.07 17.27,12.21 17.26,12.21 v17.02,12.45
  Bottom 0.178: v17.02,12.45 6.35,12.45 v4.83,10.92
V_USB
  Top 0.305: J1.VBUS1 5.39,12.61 5.18,12.39 3.1,12.39 3.05,12.45 | J1.VBUS2 5.39,7.71 5.18,7.92 3.5,7.92 3.05,8.38
  Top 0.559: 3.05,8.38 3.05,12.45 3.05,14.99 2.31,15.72 F2.1 2.31,19.84 2.79,20.32 BYP.1
VIN  (via drill 0.3)
  Top 0.178: 13.72,13.07 J4.9 19.87,13.07 20,13.2 21.22,13.2 v21.46,12.95 | 13.72,13.07 9.41,13.07 9.27,13.21 9.27,13.93 | R10.2 13.72,13.07 | R5.2 v12.7,8
  Top 0.559: D3.C D5.C 7.74,19.8 7.49,19.55 C2.+ 7.49,16.26 8.26,15.49 C1.1 C13.1 | C13.1 9.27,13.93 | U5.8 9.19,13.85 C13.1
  Bottom 0.178: v12.7,8 13.84,8 | 13.84,8 18.8,8 21.46,10.67 v21.46,12.95 | VIN_LED.2 50.28,1.51 49.78,1.02 14.48,1.02 13.84,1.65 13.84,8
  pour Top (isolate 0.178, rank 2): 10.16,11.05 8.38,11.05 8.38,14.35 10.16,14.35
VIN/3  (via drill 0.3)
  Top 0.178: v16.51,16.26 16.34,16.09 R9.2 R10.1 | J4.49 20.28,23.07 v20.57,23.37
  Bottom 0.178: v20.57,23.37 19.3,23.37 18.8,22.86 18.8,16.76 18.29,16.26 v16.51,16.26
VREG_3.3V
  pour Top (isolate 0.305): 8.38,9.27 8.38,6.35 10.16,6.35 10.16,9.27

### Text on the board
Bottom: x01
tDocu: N. Seidle